# Altium schematic sheet SRAM.SchDoc
size A4
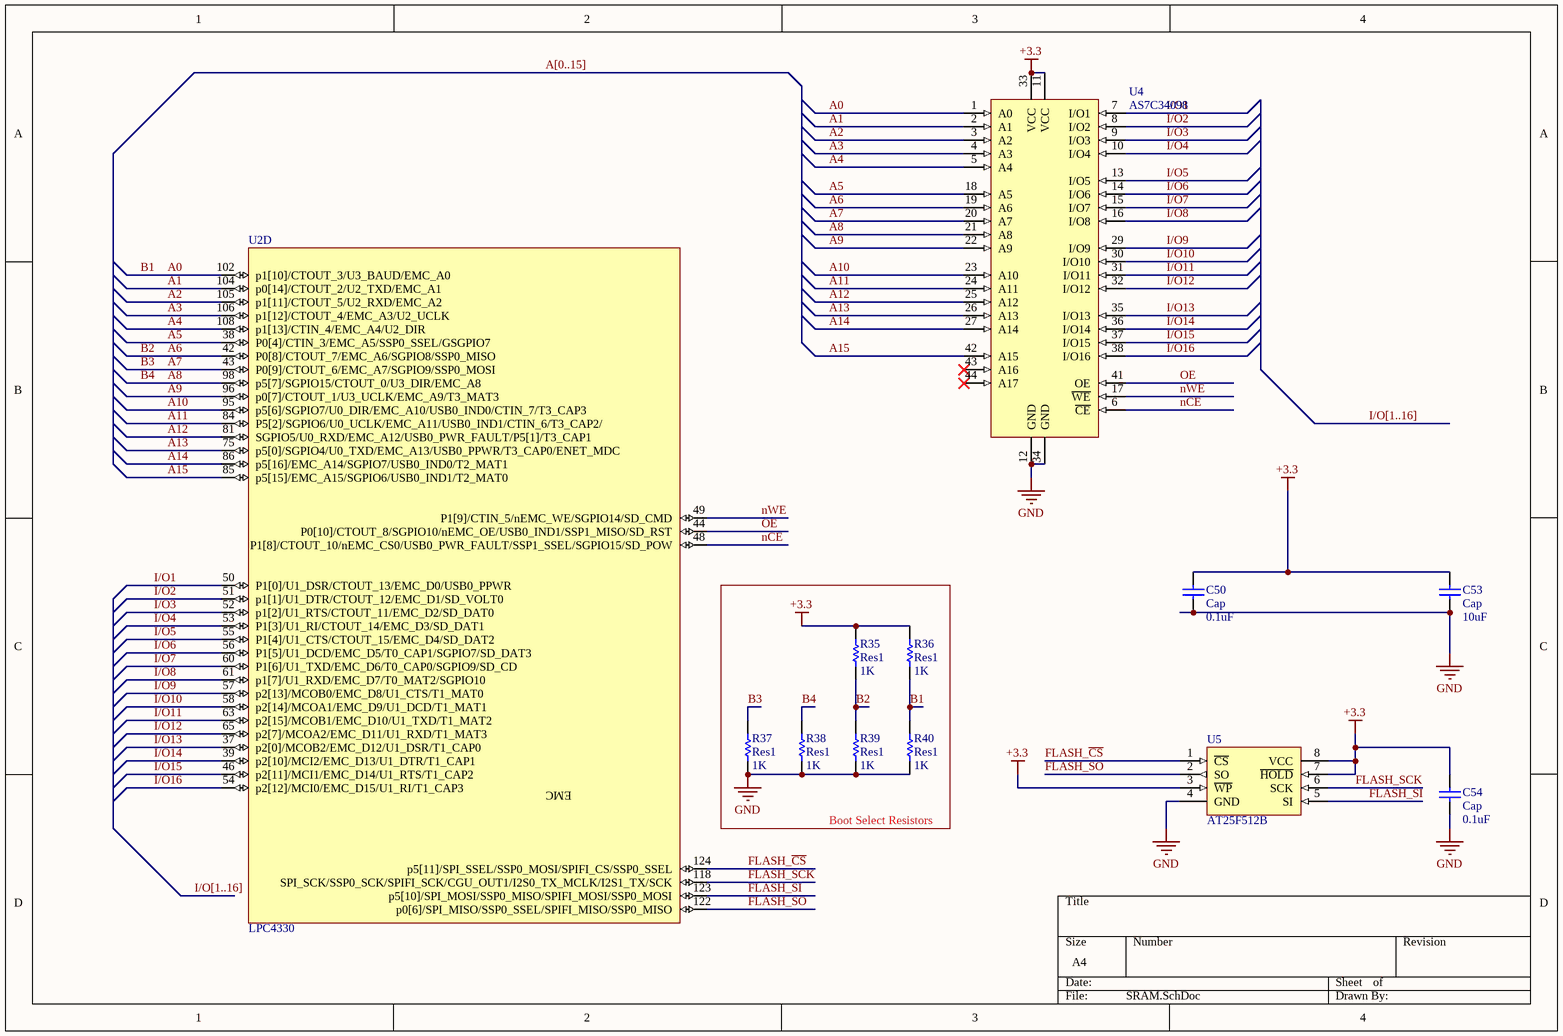
[diagram p0: SRAM.SchDoc]

## Parts
C50  Cap  value 0.1uF  [C0603]
C53  Cap  value 10uF  [C0603]
C54  Cap  value 0.1uF  [C0603]
R35  Res1  value 1K  [R0603]
R36  Res1  value 1K  [R0603]
R37  Res1  value 1K  [R0603]
R38  Res1  value 1K  [R0603]
R39  Res1  value 1K  [R0603]
R40  Res1  value 1K  [R0603]
U2  LPC4330  [TSQFP50P2200X2200X160-144N]  (part D of 5)
U4  AS7C34098  [TSOP80P1180X120-44N]
U5  AT25F512B  [SOIC127P600-8N]

## Blocks framed on the sheet
Boot Select Resistors: R35-R40

## Nets
+3.3: C50.2 C53.2 C54.2 R35.2 R36.2 U4.11(VCC) U4.33(VCC) U5.3(~{WP}) U5.7(~{HOLD}) U5.8(VCC)
GND: C50.1 C53.1 C54.1 R37.1 R38.1 R39.1 R40.1 U4.12(GND) U4.34(GND) U5.4(GND)
A0: R36.1 R40.2 U2.102(p1[10]/CTOUT_3/U3_BAUD/EMC_A0) U4.1(A0)  [also labelled B1]
A1: U2.104(p0[14]/CTOUT_2/U2_TXD/EMC_A1) U4.2(A1)
A2: U2.105(p1[11]/CTOUT_5/U2_RXD/EMC_A2) U4.3(A2)
A3: U2.106(p1[12]/CTOUT_4/EMC_A3/U2_UCLK) U4.4(A3)
A4: U2.108(p1[13]/CTIN_4/EMC_A4/U2_DIR) U4.5(A4)
A5: U2.38(P0[4]/CTIN_3/EMC_A5/SSP0_SSEL/GSGPIO7) U4.18(A5)
A6: R35.1 R39.2 U2.42(P0[8]/CTOUT_7/EMC_A6/SGPIO8/SSP0_MISO) U4.19(A6)  [also labelled B2]
A7: R37.2 U2.43(P0[9]/CTOUT_6/EMC_A7/SGPIO9/SSP0_MOSI) U4.20(A7)  [also labelled B3]
A8: R38.2 U2.98(p5[7]/SGPIO15/CTOUT_0/U3_DIR/EMC_A8) U4.21(A8)  [also labelled B4]
A9: U2.96(p0[7]/CTOUT_1/U3_UCLK/EMC_A9/T3_MAT3) U4.22(A9)
A10: U2.95(p5[6]/SGPIO7/U0_DIR/EMC_A10/USB0_IND0/CTIN_7/T3_CAP3) U4.23(A10)
A11: U2.84(P5[2]/SGPIO6/U0_UCLK/EMC_A11/USB0_IND1/CTIN_6/T3_CAP2/) U4.24(A11)
A12: U2.81(SGPIO5/U0_RXD/EMC_A12/USB0_PWR_FAULT/P5[1]/T3_CAP1) U4.25(A12)
A13: U2.75(p5[0]/SGPIO4/U0_TXD/EMC_A13/USB0_PPWR/T3_CAP0/ENET_MDC) U4.26(A13)
A14: U2.86(p5[16]/EMC_A14/SGPIO7/USB0_IND0/T2_MAT1) U4.27(A14)
A15: U2.85(p5[15]/EMC_A15/SGPIO6/USB0_IND1/T2_MAT0) U4.42(A15)
FLASH_~{CS}: U2.124(p5[11]/SPI_SSEL/SSP0_MOSI/SPIFI_CS/SSP0_SSEL) U5.1(~{CS})
FLASH_SCK: U2.118(SPI_SCK/SSP0_SCK/SPIFI_SCK/CGU_OUT1/I2S0_TX_MCLK/I2S1_TX/SCK) U5.6(SCK)
FLASH_SI: U2.123(p5[10]/SPI_MOSI/SSP0_MISO/SPIFI_MOSI/SSP0_MOSI) U5.5(SI)
FLASH_SO: U2.122(p0[6]/SPI_MISO/SSP0_SSEL/SPIFI_MISO/SSP0_MISO) U5.2(SO)
I/O1: U2.50(P1[0]/U1_DSR/CTOUT_13/EMC_D0/USB0_PPWR) U4.7(I/O1)
I/O2: U2.51(p1[1]/U1_DTR/CTOUT_12/EMC_D1/SD_VOLT0) U4.8(I/O2)
I/O3: U2.52(p1[2]/U1_RTS/CTOUT_11/EMC_D2/SD_DAT0) U4.9(I/O3)
I/O4: U2.53(P1[3]/U1_RI/CTOUT_14/EMC_D3/SD_DAT1) U4.10(I/O4)
I/O5: U2.55(P1[4]/U1_CTS/CTOUT_15/EMC_D4/SD_DAT2) U4.13(I/O5)
I/O6: U2.56(P1[5]/U1_DCD/EMC_D5/T0_CAP1/SGPIO7/SD_DAT3) U4.14(I/O6)
I/O7: U2.60(P1[6]/U1_TXD/EMC_D6/T0_CAP0/SGPIO9/SD_CD) U4.15(I/O7)
I/O8: U2.61(p1[7]/U1_RXD/EMC_D7/T0_MAT2/SGPIO10) U4.16(I/O8)
I/O9: U2.57(p2[13]/MCOB0/EMC_D8/U1_CTS/T1_MAT0) U4.29(I/O9)
I/O10: U2.58(p2[14]/MCOA1/EMC_D9/U1_DCD/T1_MAT1) U4.30(I/O10)
I/O11: U2.63(p2[15]/MCOB1/EMC_D10/U1_TXD/T1_MAT2) U4.31(I/O11)
I/O12: U2.65(p2[7]/MCOA2/EMC_D11/U1_RXD/T1_MAT3) U4.32(I/O12)
I/O13: U2.37(p2[0]/MCOB2/EMC_D12/U1_DSR/T1_CAP0) U4.35(I/O13)
I/O14: U2.39(p2[10]/MCI2/EMC_D13/U1_DTR/T1_CAP1) U4.36(I/O14)
I/O15: U2.46(p2[11]/MCI1/EMC_D14/U1_RTS/T1_CAP2) U4.37(I/O15)
I/O16: U2.54(p2[12]/MCI0/EMC_D15/U1_RI/T1_CAP3) U4.38(I/O16)
nCE: U2.48(P1[8]/CTOUT_10/nEMC_CS0/USB0_PWR_FAULT/SSP1_SSEL/SGPIO15/SD_POW) U4.6(~{CE})
nWE: U2.49(P1[9]/CTIN_5/nEMC_WE/SGPIO14/SD_CMD) U4.17(~{WE})
OE: U2.44(P0[10]/CTOUT_8/SGPIO10/nEMC_OE/USB0_IND1/SSP1_MISO/SD_RST) U4.41(OE)

Not connected (* = marked no-connect by the designer): U4 43(A16)* 44(A17)*

## Buses and harness runs
bus A[0..15]
bus I/O[1..16]

## Notes on the sheet
- (in symbol LPC4330, part D) EMC

## Library data of the parts
C50 C53 C54 = Cap: Capacitor; Published: 8-Jun-2000; LatestRevisionDate: 17-Jul-2002; LatestRevisionNote: Re-released for DXP Platform.; PackageReference: RAD-0.3; Publisher: Altium Limited
R35-R40 = Res1: Resistor; Published: 8-Jun-2000; LatestRevisionDate: 17-Jul-2002; LatestRevisionNote: Re-released for DXP Platform.; PackageReference: AXIAL-0.3; Publisher: Altium Limited
U2 = LPC4330: MCU, 32BIT, ARM CORTEX M4&M0, 144LQFP; farnell: 2094316
U4 = AS7C34098: SRAM, 4MB, 3V, 12NS, 256K x 16, TSOP44; farnell: 1562920
U5 = AT25F512B: MEMORY, DATAFLASH, 512K, SPI, 8SOIC; farnell: 1715445